# EasyEDA Pro project Modular-Analog-Synthesizer.eprj, schematic Schematic2
Board Name: VCO; Create Date: 2026-03-18; Page Name: VCO-circuit; Project Name: Modular-Analog-Synthesizer; Schematic Name: Schematic2; Update Date: 2026-04-14; Company: EasyEDA.com; Page Size: A4; Version: V1.0
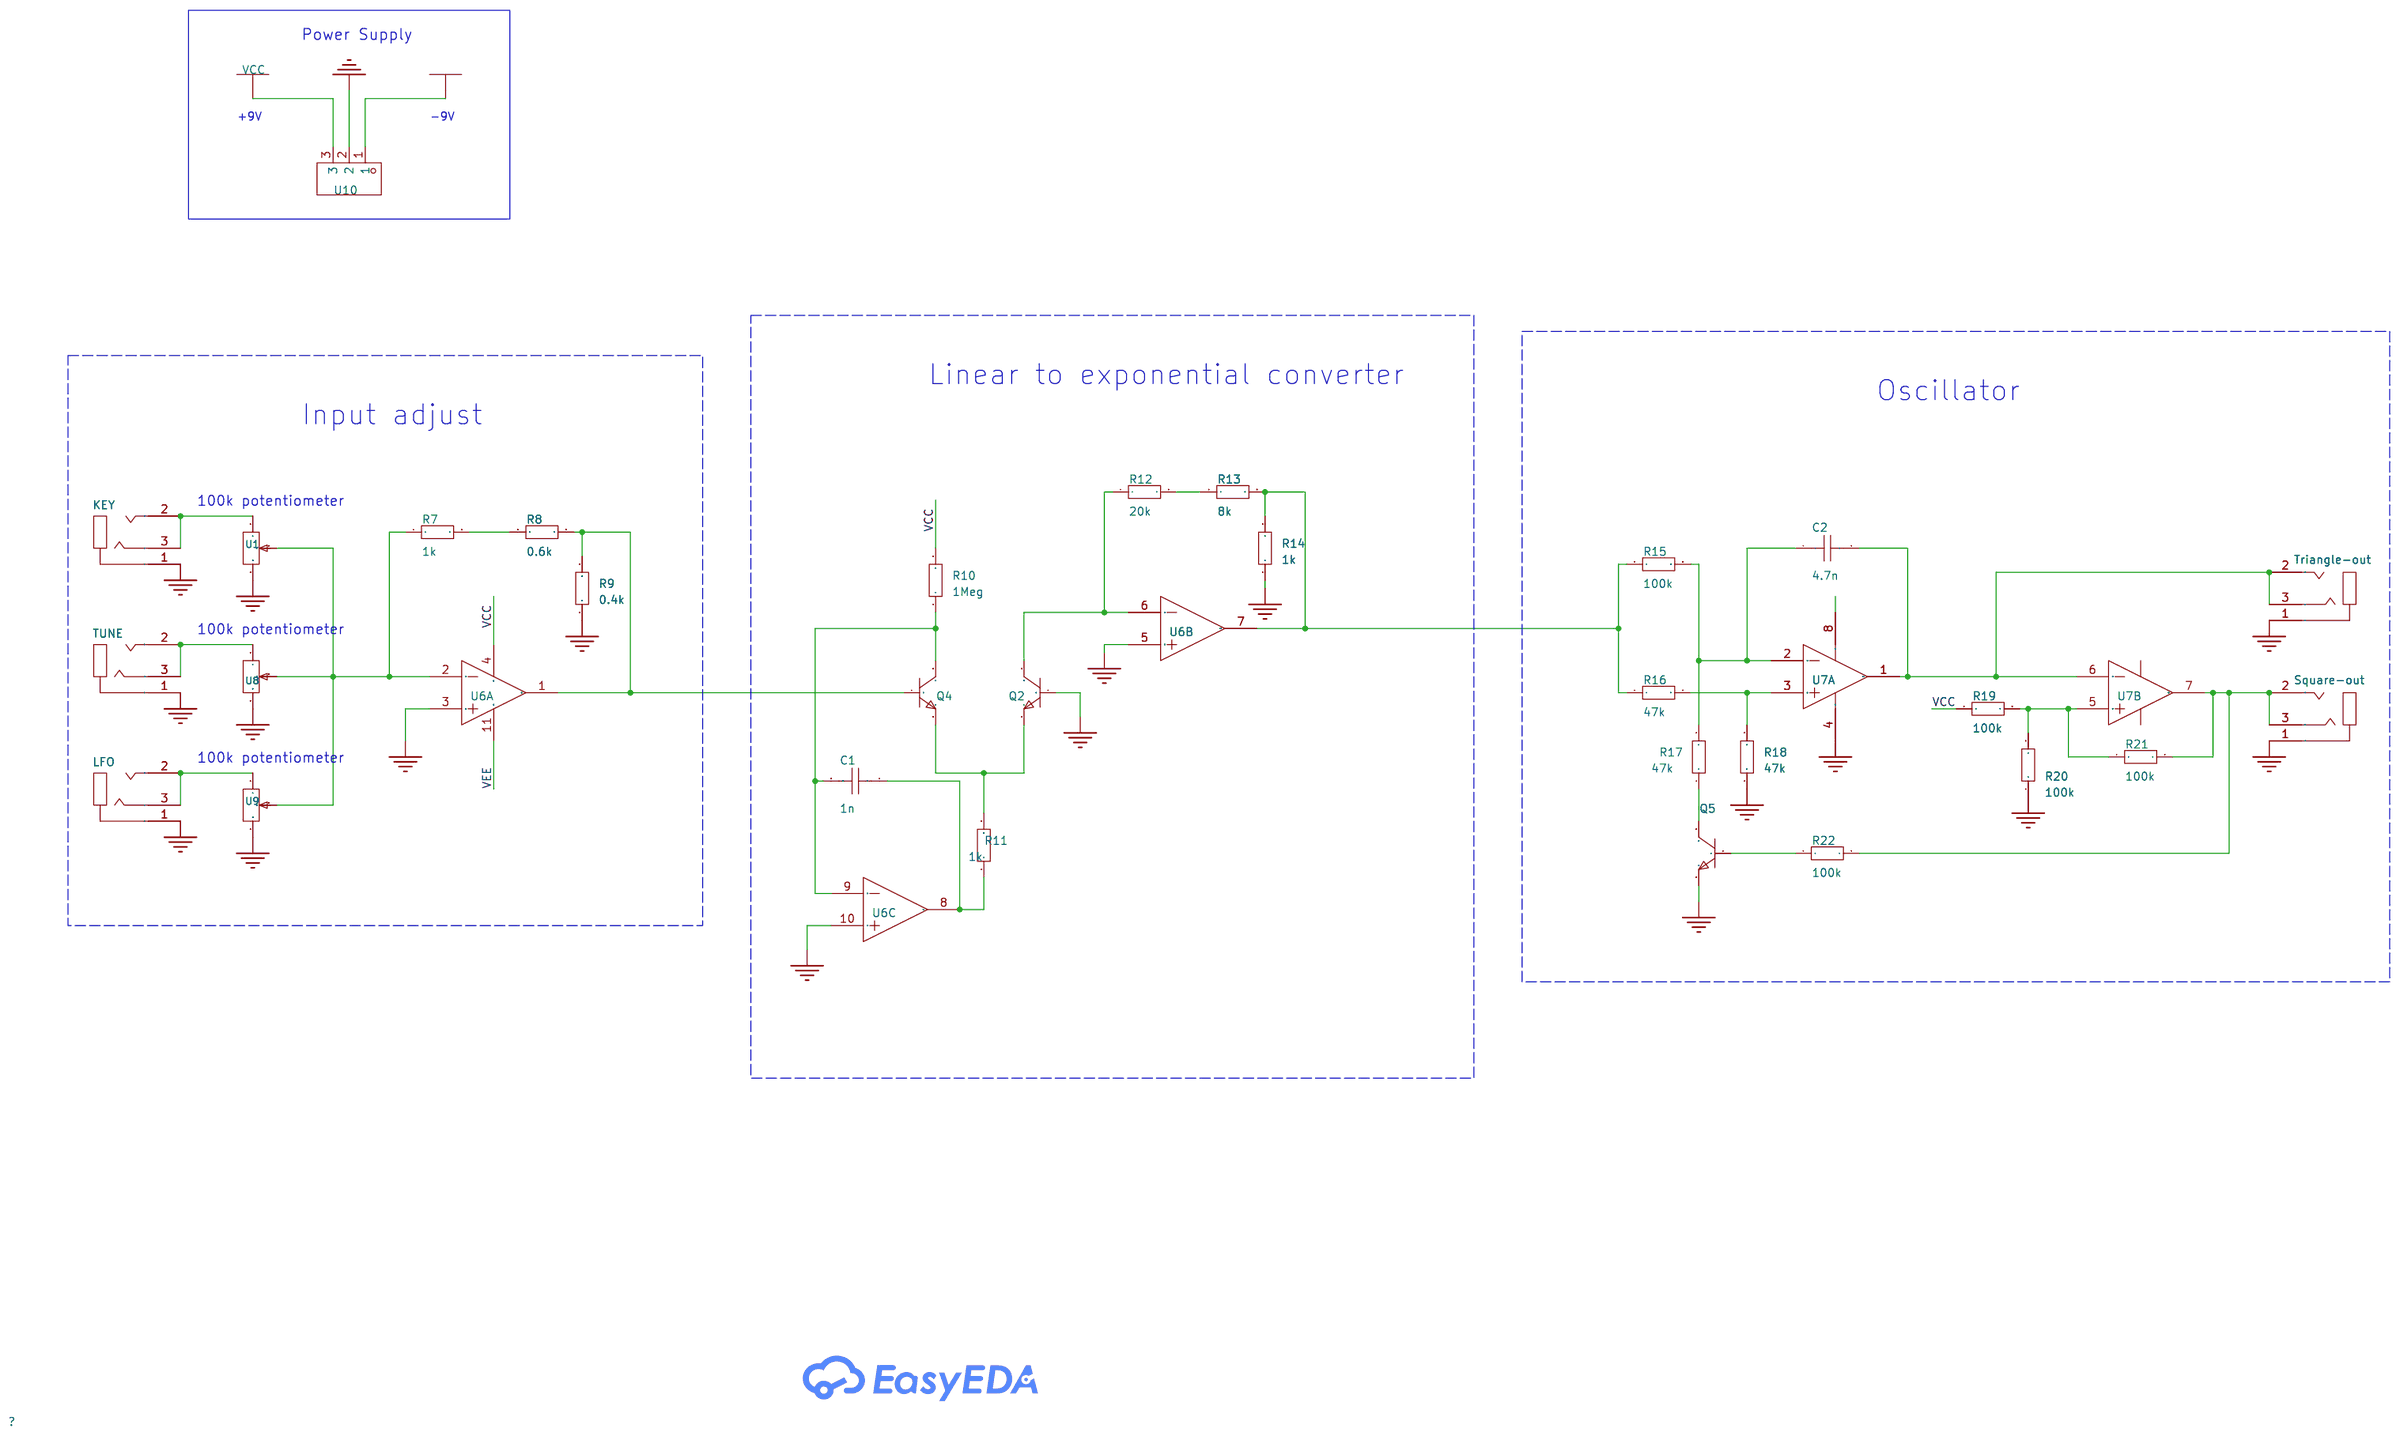
[diagram p1: schematic sheet]

## Parts
C1  1n  [C0603]
C2  4.7n  [C0603]
KEY  -  [AUDIO-SMD_PJ-313D]
LFO  -  [AUDIO-SMD_PJ-313D]
Q2  -  [SOT-23-3_L2.9-W1.3-P1.90-LS2.4-BR]
Q4  -  [SOT-23-3_L2.9-W1.3-P1.90-LS2.4-BR]
Q5  -  [SOT-23-3_L2.9-W1.3-P1.90-LS2.4-BR]
R7  1k  [R0603]
R8  0.6k  [R0603]
R9  0.4k  [R0603]
R10  1Meg  [R0603]
R11  1k  [R0603]
R12  20k  [R0603]
R13  8k  [R0603]
R14  1k  [R0603]
R15  100k  [R0603]
R16  47k  [R0603]
R17  47k  [R0603]
R18  47k  [R0603]
R19  100k  [R0603]
R20  100k  [R0603]
R21  100k  [R0603]
R22  100k  [R0603]
Square-out  -  [AUDIO-SMD_PJ-313D]
Triangle-out  -  [AUDIO-SMD_PJ-313D]
TUNE  -  [AUDIO-SMD_PJ-313D]
U1  Pot-100k  [RES-ADJ-SMD_VG039NCH]
U6  -  [SOIC-14_L8.7-W3.9-P1.27-LS6.0-BL]  (sections 1,2,3)
U7  -  [DIP-8_L9.6-W6.4-P2.54-LS7.6-BL-1]  (sections 1,2)
U8  Pot-100k  [RES-ADJ-SMD_VG039NCH]
U9  Pot-100k  [RES-ADJ-SMD_VG039NCH]
U10  -  [CONN-TH_3P-P5.00_KF301-5.0-3P]

## Library data of the parts
C1 C2 = CAP_0603: Supplier Footprint: 0603
KEY LFO Square-out Triangle-out TUNE = PJ-313D-6A: LCSC Part Name: 3.5mm耳机座; Supplier Part: C95463; Manufacturer: 韩国韩荣; Supplier Footprint: SMD; JLCPCB Part Class: Extended Part; Datasheet: https://atta.szlcsc.com/upload/public/pdf/source/20191118/C95463_33C76E25D98A90BB88D1795912C97EA2.pdf; Supplier: LCSC; Connector Type: 3.5mm耳机座; Current Rating (Max): 500mA; Voltage Rating (Max): 30V
Q2 Q4 Q5 = MMBT5551: LCSC Part Name: MMBT5551 G1 H档200-300 G1 H档200-300; Supplier Part: C2145; Manufacturer: CJ（江苏长电/长晶）; Supplier Footprint: SOT-23(SOT-23-3); JLCPCB Part Class: Basic Part; Datasheet: https://atta.szlcsc.com/upload/public/pdf/source/20140809/1457707209203.pdf; Supplier: LCSC; Collector Cut-Off Current (Icbo): 50nA; Collector-Emitter Saturation Voltage (VCE(sat)@Ic,Ib): 200mV@50mA,5mA; DC Current Gain (hFE@Ic,Vce): 200@10mA,5V; Transition Frequency (fT): 100MHz; Operating Temperature: +150℃@(Tj)
R7-R22 = Res_0603: Supplier Footprint: 0603
U1 U8 U9 = 3*3Potentiometer-10kΩ20%: Supplier Part: C9900010776; Supplier Footprint: SMD-3P; JLCPCB Part Class: Extended Part; Supplier: LCSC
U6 = TL074CDR: Supplier Part: C12594; Manufacturer: TI(德州仪器); Supplier Footprint: SOIC-14_150mil; JLCPCB Part Class: Extended Part; Datasheet: https://atta.szlcsc.com/upload/public/pdf/source/20130805/1457706631526.pdf; Supplier: LCSC
U7 = TL072CP: Supplier Part: C7236; Manufacturer: TI(德州仪器); Supplier Footprint: DIP-8; JLCPCB Part Class: Extended Part; Datasheet: https://atta.szlcsc.com/upload/public/pdf/source/20140704/1457707129967.pdf; Supplier: LCSC
U10 = KF301-5.0-3P: LCSC Part Name: 5mm 排数:1 每排P数:3 直针 可拼接 铜 环保; Supplier Part: C474882; Manufacturer: KEFA(科发); Supplier Footprint: P=5mm; JLCPCB Part Class: Extended Part; Datasheet: https://atta.szlcsc.com/upload/public/pdf/source/20200115/C474882_067BD45A25E5311BED9DE634CF3E69D8.pdf; Supplier: LCSC; Pitch: 5mm; Number of Rows: 1; Number of PINs Per Row: 3; Mounting Style: 直针; Current Rating (Max): 17A; Voltage Rating (Max): 250V; Wire Gauge - AWG: 14~22; Wire Gauge - mm?: 1.5; Operating Temperature Range: -30℃~+120℃; Color: Blue

## Nets
GND: KEY.1 LFO.1 Q2.1(B) Q5.2(E) R9.1 R14.1 R18.1 R20.1 Square-out.1 Triangle-out.1 TUNE.1 U1.3 U6.3(IN1+) U6.5(IN2+) U6.10(IN3+) U7.4(VCC-) U8.3 U9.3 U10.2
VCC: R10.2 R19.1 U6.4(VCC+) U10.3
VEE: U6.11(VCC-) U10.1
$1N908: R7.1 U1.2 U6.2(IN1-) U8.2 U9.2
$1N1390: R7.2 R8.1
$1N1601: C1.2 Q4.3(C) R10.1 U6.9(IN3-)
$1N1617: Q2.2(E) Q4.2(E) R11.2
$1N1710: C1.1 R11.1 U6.8(OUT3)
$1N1876: Q2.3(C) R12.1 U6.6(IN2-)
$1N2057: R12.2 R13.1
$1N2452: C2.1 R15.2 R17.2 U7.2(IN1-)
$1N2464: Q5.3(C) R17.1
$1N2551: R16.2 R18.2 U7.3(IN1+)
$1N2709: C2.2 Triangle-out.2 Triangle-out.3 U7.1(OUT1) U7.6(IN2-)
$1N2952: R19.2 R20.2 R21.1 U7.5(IN2+)
$1N2993: Q5.1(B) R22.1
$1N3031: R21.2 R22.2 Square-out.2 Square-out.3 U7.7(OUT2)
$1N4427: Q4.1(B) R8.2 R9.2 U6.1(OUT1)
$1N4457: R13.2 R14.2 R15.1 R16.1 U6.7(OUT2)
$1N5698: TUNE.2 TUNE.3 U8.1
$1N5746: LFO.2 LFO.3 U9.1
$1N5794: KEY.2 KEY.3 U1.1

Not connected (* = marked no-connect by the designer): U7 8(VCC+)

## Notes on the sheet
- Power Supply
- +9V
- -9V
- Linear to exponential converter
- Oscillator
- Input adjust
- 100k potentiometer
- 100k potentiometer
- 100k potentiometer
